# EAGLE design JDM2_2-Voltage_SW1P_mConn (EAGLE 7.7.0)
JDM2 with selectable Dual-Voltage
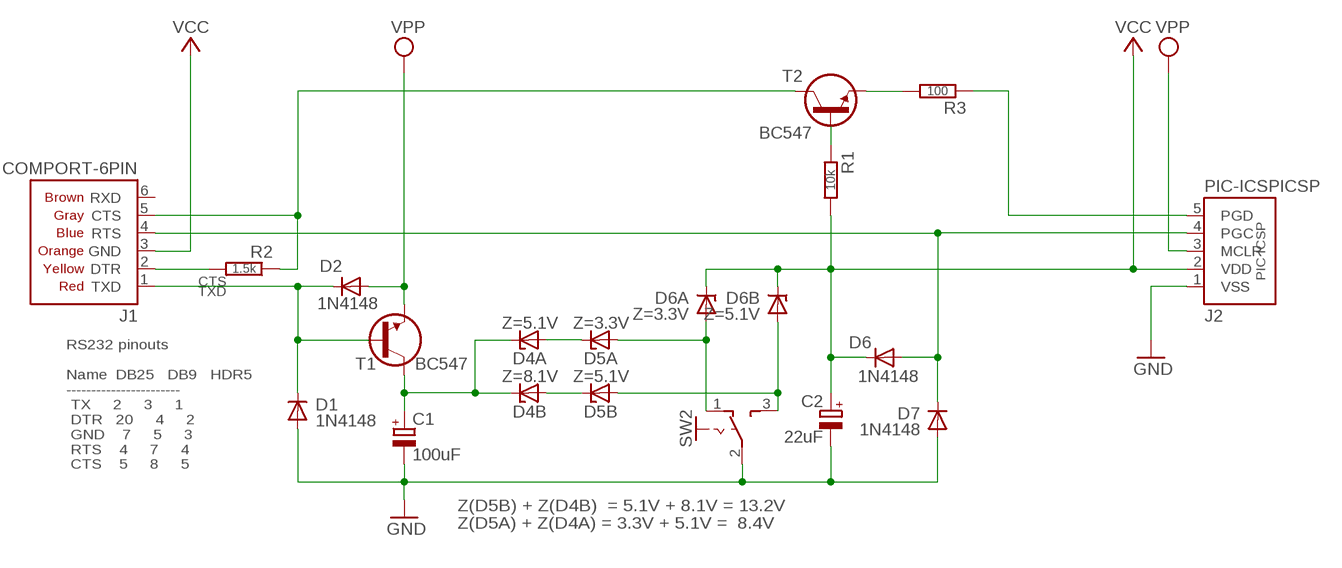
[diagram p0: schematic, sheet 1]

## Parts
C1  100uF  CPOLE2.5-5  [E2,5-5]
C2  22uF  CPOLE2,5-4  [E2,5-4]
D1  1N4148  1N414834-5  [DO34-5]
D2  1N4148  1N414834-5  [DO34-5]
D4A  Z=5.1V  Z-DIODE34Z2,5  [DO34Z2,5]
D4B  Z=8.1V  Z-DIODE34Z2,5  [DO34Z2,5]
D5A  Z=3.3V  Z-DIODE34Z5  [DO34Z5]
D5B  Z=5.1V  Z-DIODE34Z5  [DO34Z5]
D6  1N4148  1N414834-5V  [DO34-5V]
D6A  Z=3.3V  Z-DIODE34Z10V  [DO34Z10V]
D6B  Z=5.1V  Z-DIODE34Z10V  [DO34Z10V]
D7  1N4148  1N414834-7V  [DO34-7V]
J1  COMPORT-6PIN  [RS232-6PIN]
J2  PIC-ICSPICSP  [PIC-ICSP]
R1  10k  R0202/7-V  [0202/7-V]
R2  1.5k  R0202/7-V  [0202/7-V]
R3  100  R0202/7  [0202/7]
SW2  SL-SW-1P-2T-H  [SLSW-1P2T-H]
T1  BC547  BC547CBE  [TO92-CBE]
T2  BC547  BC547CBE  [TO92-CBE]

## Nets
/MCLR: D2.A J2.3(MCLR) T1.E ; supply symbol labelled VPP
CLK: D6.A D7.C J1.4(RTS) J2.4(PGC)
CTS: J1.5(CTS) R2.1 T2.C
DATA: R3.2 T2.E
GND: C1.- C2.- D1.A D7.A J2.1(VSS) SW2.2(P)
N$1: R1.1 T2.B
N$2: D5A.A D6A.A SW2.1(O)
N$3: D5B.A D6B.A SW2.3(S)
N$5: D4A.A D5A.C
N$7: J1.2(DTR) R2.2
N$8: D4B.A D5B.C
PGD: J2.5(PGD) R3.1
TXD: D1.C D2.C J1.1(TXD) T1.B
VCC: C2.+ D6.C D6A.C D6B.C J1.3(GND) J2.2(VDD) R1.2
VPP: C1.+ D4A.C D4B.C T1.C
Unconnected: J1.6(RXD)

## Notes on the sheet
- RS232 pinouts
  
  Name  DB25   DB9   HDR5
  -----------------------
   TX     2     3     1
   DTR   20     4     2
   GND    7     5     3
   RTS    4     7     4
   CTS    5     8     5
- Z(D5B) + Z(D4B)  = 5.1V + 8.1V = 13.2V
  Z(D5A) + Z(D4A) = 3.3V + 5.1V =  8.4V

## Library data of the parts
C1 C2 = c:CPOL: POLARIZED CAPACITOR, European symbol
D1 D2 D6 D7 = d:1N4148
D4A D4B D5A D5B D6A D6B = d:Z-DIODE
J1 = pinconn:COMPORT-6PIN
J2 = pinconn:PIC-ICSP
R1-R3 = r:R: RESISTOR, European symbol
SW2 = sw:SL-SW-1P-2T
T1 T2 = t:BC547

## Net classes
0 default: width 0.559 mm
1 power: width 0.559 mm

## Board
JDM2 with selectable Dual-Voltage
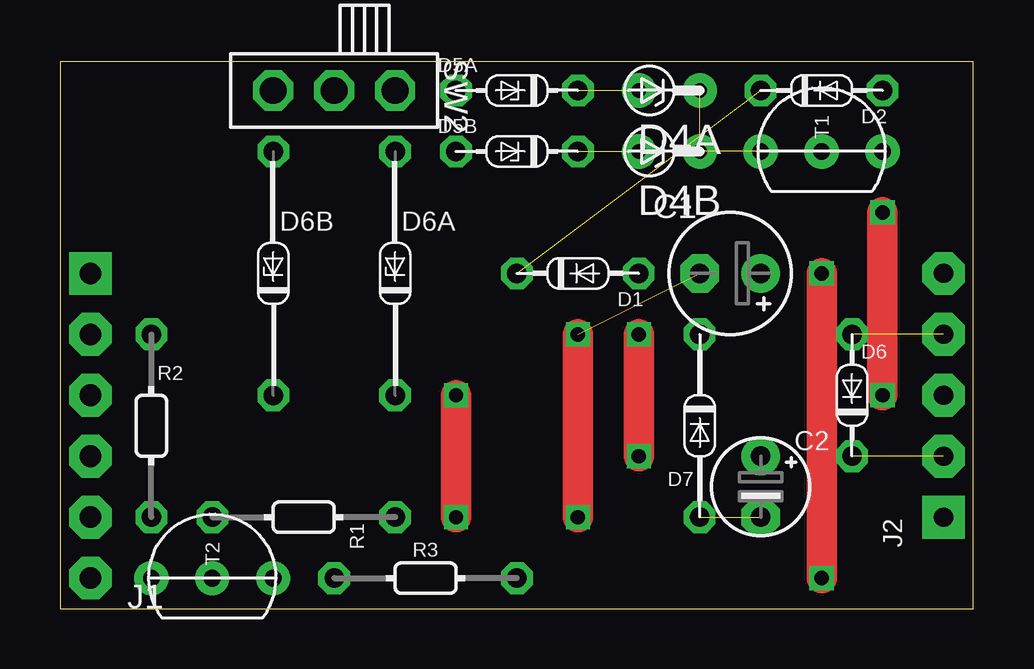
[diagram p1: board, top side]
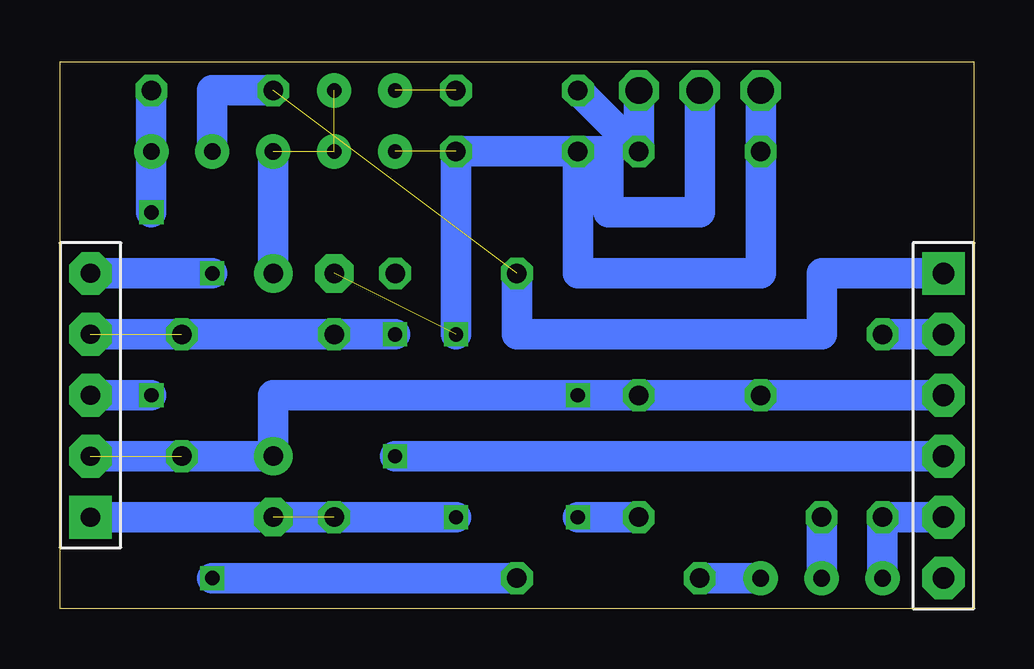
[diagram p2: board, bottom side, seen from below]

Size 38.08 x 22.78 mm. Coordinates in mm from the lower left corner, seen from the top.
Outline: 0,0 38.08,0 38.08,22.78 0,22.78 0,0
Copper layers (1*16): Top 0.035mm / dielectric 1.5mm / Bottom 0.035mm
Design rules "default": minimum track width 10mil, minimum drill 24mil, track to track 8mil, track to pad 8mil, pad to pad 8mil, via to via 8mil, smd to smd 8mil, copper to edge 40mil, drill to drill 8mil, minimum pad ring 10mil, minimum via ring 8mil, stop-mask expansion 4mil, vias tented up to drill 0mil, thermal gap 10mil

### Footprints (pad centres in the part's own frame; a part is rotated, then mirrored left to right if it is on the bottom)
E2,5-5 = drill 0.813 pad 1.6: + 1.27,0 | drill 0.813 pad 1.6 octagon: - -1.27,0
E2,5-4 = drill 0.813 pad 1.6: + 0,-1.27 | drill 0.813 pad 1.6 octagon: - 0,1.27
DO34-5 = drill 0.813 octagon: A 2.54,0; C -2.54,0
DO34Z2,5 = drill 0.6 pad 1.422: A 1.27,0; C -1.27,0
DO34Z5 = drill 0.813 octagon: A -2.54,0; C 2.54,0
DO34-5V = drill 0.813 octagon: A 0,2.54; C 0,-2.54
DO34Z10V = drill 0.813 octagon: A 0,5.08; C 0,-5.08
DO34-7V = drill 0.813 octagon: A 0,3.81; C 0,-3.81
RS232-6PIN = drill 0.9 pad 1.778 square: 1 0,0 | drill 0.9 pad 1.778 octagon: 2 0,2.54; 3 0,5.08; 4 0,7.62; 5 0,10.16; 6 0,12.7
PIC-ICSP = drill 0.8 pad 1.778 square: 1 -5.08,0 | drill 0.8 pad 1.778 octagon: 2 -2.54,0; 3 0,0; 4 2.54,0; 5 5.08,0
0202/7-V = drill 0.813 octagon: 1 0,-3.81; 2 0,3.81
0202/7 = drill 0.813 octagon: 1 -3.81,0; 2 3.81,0
SLSW-1P2T-H = drill 1.118 pad 1.524 octagon: 1 2.54,0; 2 0,0; 3 -2.54,0
TO92-CBE = drill 0.7 pad 1.422: B 0,0; C 0,2.54; E 0,-2.54

### Placement (x,y rotation side)
C1  27.94,13.97 0 top
C2  29.21,5.08 180 top
D1  21.59,13.97 0 top
D2  31.75,21.59 0 top
D4A  25.4,21.59 180 top
D4B  25.4,19.05 180 top
D5A  19.05,21.59 0 top
D5B  19.05,19.05 0 top
D6  33.02,8.89 0 top
D6A  13.97,13.97 0 top
D6B  8.89,13.97 0 top
D7  26.67,7.62 180 top
J1  1.27,13.97 180 top
J2  36.83,8.89 90 top
R1  10.16,3.81 270 top
R2  3.81,7.62 0 top
R3  15.24,1.27 180 top
SW2  11.43,21.59 0 top
T1  31.75,19.05 90 top
T2  6.35,1.27 90 top

### Tracks (layer width: path | path; a pad name or v marks a point on that pad's centre or on a via)
/MCLR  (via drill 0.6)
  Top 1.27: v34.29,16.51 v34.29,8.89
  Bottom 1.27: v34.29,16.51 T1.E D2.A | v34.29,8.89 J2.3
CLK  (via drill 0.6)  (1 unrouted)
  Top 1.27: v24.13,6.35 v24.13,11.43
  Bottom 1.27: J2.4 D7.C v24.13,11.43 | v24.13,6.35 J1.4
CTS
  Bottom 1.27: J1.5 R2.1 T2.C
DATA
  Bottom 1.27: R3.2 T2.E
GND  (via drill 0.6)  (3 unrouted)
  Top 1.27: v21.59,11.43 v21.59,3.81
  Bottom 1.27: C2.- v21.59,3.81 J2.1 | SW2.2 11.43,16.51 15.24,16.51 15.24,19.05 21.59,19.05 v21.59,11.43
N$1
  Bottom 1.27: R1.1 T2.B
N$2
  Bottom 1.27: D5A.A D6A.A SW2.1
N$3
  Bottom 1.27: D6B.A SW2.3 8.89,13.97 16.51,13.97 D5B.A
N$5  (1 unrouted)
N$7
  Bottom 1.27: J1.2 R2.2
N$8  (1 unrouted)
PGD  (via drill 0.6)
  Top 1.27: v31.75,1.27 v31.75,13.97
  Bottom 1.27: R3.1 v31.75,1.27 | v31.75,13.97 J2.5
TXD  (1 unrouted)
  Bottom 1.27: D2.C 31.75,21.59 T1.B | J1.1 6.35,13.97 6.35,11.43 19.05,11.43 D1.C
VCC  (via drill 0.6)  (1 unrouted)
  Top 1.27: v16.51,3.81 v16.51,8.89
  Bottom 1.27: J1.3 D6B.C D6A.C v16.51,8.89 29.21,8.89 C2.+ J2.2 | R1.2 v16.51,3.81
VPP  (2 unrouted)
  Bottom 1.27: C1.+ T1.C